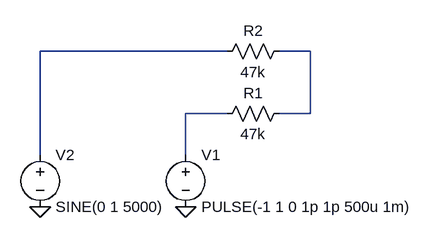
[diagram p0: schematic analog_per.asc]
analog_per.asc, the LTspice schematic file:
Version 4
SHEET 1 880 680
WIRE 192 64 -96 64
WIRE 320 64 272 64
WIRE 192 160 128 160
WIRE 320 160 320 64
WIRE 320 160 272 160
WIRE -96 224 -96 64
WIRE 128 224 128 160
FLAG 128 304 0
FLAG -96 304 0
SYMBOL res 288 144 R90
WINDOW 0 0 56 VBottom 2
WINDOW 3 32 56 VTop 2
SYMATTR InstName R1
SYMATTR Value 47k
SYMBOL res 288 48 R90
WINDOW 0 0 56 VBottom 2
WINDOW 3 32 56 VTop 2
SYMATTR InstName R2
SYMATTR Value 47k
SYMBOL voltage 128 208 R0
WINDOW 123 0 0 Left 2
WINDOW 39 0 0 Left 2
SYMATTR InstName V1
SYMATTR Value PULSE(-1 1 0 1p 1p 500u 1m)
SYMBOL voltage -96 208 R0
WINDOW 123 0 0 Left 2
WINDOW 39 0 0 Left 2
SYMATTR InstName V2
SYMATTR Value SINE(0 1 5000)

The netlist it stands for:
* analog_per.asc
R1 N002 N003 47k
R2 N002 N001 47k
V1 N003 0 PULSE(-1 1 0 1p 1p 500u 1m)
V2 N001 0 SINE(0 1 5000)
.backanno
.end